# Altium project PB-F-0230 SUPI Medium R2.PrjPcb
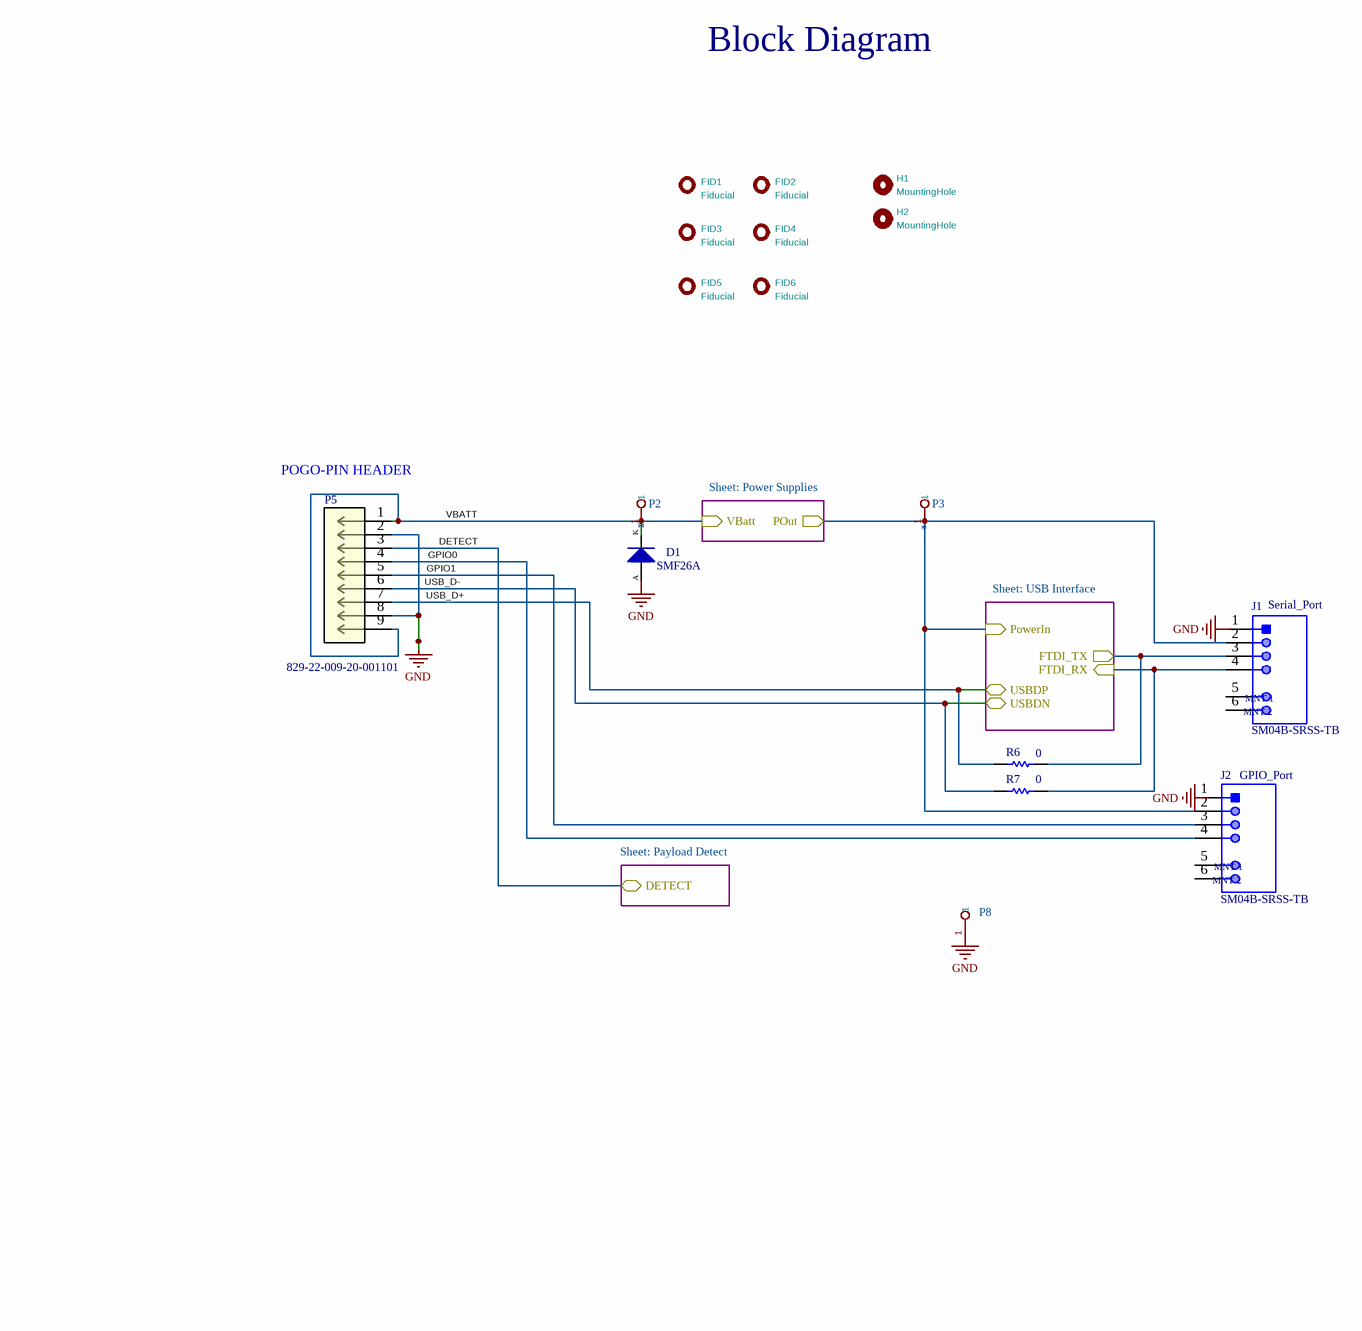
[diagram p0: SUPI_MediumR2.SchDoc]

4 sheets, 54 parts. Net scope: hierarchical (ports join the sheet entries above them; power ports are global).
Board file: SUPI_MediumR2.PcbDoc
Sheets:
  SUPI_MediumR2.SchDoc
    Payload Detect = payload_detect.SchDoc
    USB Interface = SOUP_USB.SchDoc
    Power Supplies = power_supplies.SchDoc

## Sheet SUPI_MediumR2.SchDoc
size 558 x 431 mm; SheetNumber: 1; SheetTotal: 4

### Parts
D1  SMF26A  [DI-SOD123F-A]
FID1  Fiducial  [Fiducial_Cu0.040_Mask0.060]  (no BOM)
FID2  Fiducial  [Fiducial_Cu0.040_Mask0.060]  (no BOM)
FID3  Fiducial  [Fiducial_Cu0.040_Mask0.060]  (no BOM)
FID4  Fiducial  [Fiducial_Cu0.040_Mask0.060]  (no BOM)
FID5  Fiducial  [Fiducial_Cu0.040_Mask0.060]  (no BOM)
FID6  Fiducial  [Fiducial_Cu0.040_Mask0.060]  (no BOM)
H1  MountingHole  [MountingHole_2.2mm_M2_DIN965]  (no BOM)
H2  MountingHole  [MountingHole_2.2mm_M2_DIN965]  (no BOM)
J1  SM04B-SRSS-TB  [SM04B-SRSS-TB]
J2  SM04B-SRSS-TB  [SM04B-SRSS-TB]
P2  *  [TP_SMD_1MM]  (no BOM)
P3  *  [TP_SMD_1MM]  (no BOM)
P5  829-22-009-20-001101  [829-22-009-20-001101]
P8  (no value)  [TP_SMD_1MM]  (no BOM)
R6  value 0  [RES-0402-A]  (hidden comment: Res 0402 0 Ohm 1/16W 5% Thick Film)
R7  value 0  [RES-0402-A]  (hidden comment: Res 0402 0 Ohm 1/16W 5% Thick Film)

### Sub-sheets
Payload Detect = payload_detect.SchDoc: DETECT (bidir)
Power Supplies = power_supplies.SchDoc: POut (out), VBatt (in)
USB Interface = SOUP_USB.SchDoc: FTDI_RX (in), FTDI_TX (out), USBDN (bidir), USBDP (bidir), PowerIn (in)

### Nets
GND: P5.2 P5.8 P8.1
DETECT: P5.3 ; sheet Payload Detect/DETECT
GPIO0: J2.4 P5.4
GPIO1: J2.3 P5.5
USB_D+: P5.7 R6.1 ; sheet USB Interface/USBDP
USB_D-: P5.6 R7.1 ; sheet USB Interface/USBDN
VBATT: D1.K P2.1 P5.1 P5.9 ; sheet Power Supplies/VBatt
NetC12_2: J1.2 J2.2 P3.1 ; sheet USB Interface/PowerIn, sheet Power Supplies/POut
NetJ1_3: J1.3 R6.2 ; sheet USB Interface/FTDI_TX
NetJ1_4: J1.4 R7.2 ; sheet USB Interface/FTDI_RX

Not connected (* = marked no-connect by the designer): D1 A; J1 1 5 6; J2 1 5 6

### Notes on the sheet
- Block Diagram
- (near P5) POGO-PIN HEADER
- Sheet: Power Supplies
- Sheet: USB Interface
- (near J1) Serial_Port
- (near J2) GPIO_Port
- Sheet: Payload Detect
- Labels drawn without touching a wire or pin: GND
- REVISIONS
- REVISION
- DESCRIPTION
- DATE(YEAR-MO-DA)
- APPROVED
- DWG NO
- SH
- THIS DRAWING IS CAD MAINTAINED.
  CHANGES SHALL BE INCORPORATED
  BY THE DESIGN ACTIVITY.
- PART NO.
- CONTRACT NUMBER
- DESIGN ACTIVITY
- CONTRACTOR
- US ARMY
  COMBAT CAPABILITIES DEVELOPMENT COMMAND ARMAMENTS CENTER
  PICATINNY ARSENAL, NEW JERSEY 07806-5000
- DRAWN BY
- ENGINEER
- CHECKER
- QUALITY ENGINEER
- DRAWING APPROVAL
- SIZE
- CAGE CODE
- DWG NO.
- NEXT ASSY
- USED ON
- DESIGN APPROVAL
- C
- 19200
- APPLICATION
- SCALE
- NONE
- UNIT WT.
- ---
- SHEET
- (in symbol CONN-00456-1) MNT 1; MNT 2

### Library data of the parts
D1 = CMP-00657-2: SMF Series 200 W 26 V Uni-Directional Surface Mount TVS Diode - SOD-123F; Breakdown Voltage: 30.4V; Clamping Voltage: 42.1V; Max Breakdown Voltage: 31.9V; Max Power Dissipation: 1W; Max Reverse Leakage Current: 1µA; Max Surge Current: 4.8A; Min Breakdown Voltage: 28.9V; Number of Channels: 1; Peak Pulse Power: 1kW; Polarity: Unidirectional; Power Line Protection: No; Reverse Standoff Voltage: 26V; Test Current: 1mA; Composition: Zener; Lead Free: Lead Free; Lifecycle Status: Production; Max Operating Temperature: 150°C; Min Operating Temperature: -65°C; Mounting Technology: Surface Mount; Number of Elements: 1; Number of Terminals: 2; Number of Unidirectional Channels: 1; Packaging: Cut Tape; Peak Pulse Current: 4.8A; Peak Reverse Current: 1µA; REACH SVHC: No; Reverse Voltage: 26V; RoHS: Compliant; Schedule B: 8541100080; Termination: SMD/SMT
FID1-FID6 = Fiducial_40mil_mask_60mil: Value: Fiducial
J1 J2 = CONN-00456-1: Conn Shrouded Header (4 Sides) HDR 4 POS 1.25mm Solder RA Side Entry SMD T/R; Connector Type: Male Pin; Number of Contacts: 4; Pitch: 990.6µm; Pin Count: 4; Pins: 6; Number of Positions: 4; Number of Rows: 1; Orientation: Right Angle
P2 P3 P8 = Hand_Solder_Pad_100x80_mil
P5 = CONN-00457-1: Board Connector, 9 Contact(s), 1 Row(s), Male, Right Angle, Solder Terminal; Leader Qty: 5; Number of Contacts: 9; Pitch: 2.54mm; System: Connector; Contact Gender: Male; Contact Plating: Gold; Number of Rows: 1; Termination: Solder
R6 R7 = RES-00249-8: Leader Qty: 100; Case/Package: 0402; Max Operating Temperature: 155°C; Min Operating Temperature: -55°C; RoHS Compliant: Yes
H1 H2 = MountingHole: Value: MountingHole

## Sheet payload_detect.SchDoc
size 558 x 431 mm; SheetNumber: 2; SheetTotal: 4
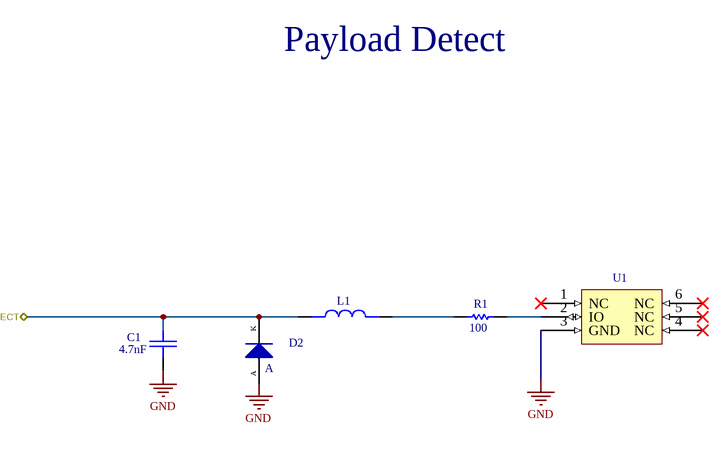
[diagram p1: payload_detect.SchDoc]

### Parts
C1  value 4.7nF  [CAP-0402-A]  (hidden comment: CAP 0402 4700PF 50V 10% X7R)
D2  A  [DI-SOD123F-A]
L1  MDF2016BSS270C  [IND-0806-A]  (value not drawn)
R1  value 100  [RES-0402-B]  (hidden comment: Res 0402 100 Ohm 0.1W 1% Thick Film)
U1  DS2431Q-TR  [IC-TDFN3X3-B]  (value not drawn)

### Ports
DETECT (bidir)

### Nets
GND: C1.1 U1.3(GND)
DETECT: C1.2 D2.K L1.1 ; port DETECT
NetL1_2: L1.2 R1.1
NetR1_2: R1.2 U1.2(IO)

Not connected (* = marked no-connect by the designer): D2 A; U1 1(NC)* 4(NC)* 5(NC)* 6(NC)*

### Notes on the sheet
- Payload Detect
- Labels drawn without touching a wire or pin: GND
- REVISIONS
- REVISION
- DESCRIPTION
- DATE(YEAR-MO-DA)
- APPROVED
- DWG NO
- SH
- THIS DRAWING IS CAD MAINTAINED.
  CHANGES SHALL BE INCORPORATED
  BY THE DESIGN ACTIVITY.
- PART NO.
- CONTRACT NUMBER
- DESIGN ACTIVITY
- CONTRACTOR
- US ARMY
  COMBAT CAPABILITIES DEVELOPMENT COMMAND ARMAMENTS CENTER
  PICATINNY ARSENAL, NEW JERSEY 07806-5000
- DRAWN BY
- ENGINEER
- CHECKER
- QUALITY ENGINEER
- DRAWING APPROVAL
- SIZE
- CAGE CODE
- DWG NO.
- NEXT ASSY
- USED ON
- DESIGN APPROVAL
- C
- 19200
- APPLICATION
- SCALE
- NONE
- UNIT WT.
- ---
- SHEET

### Library data of the parts
C1 = CAP-00371-1: Leader Qty: 100; UOM: EA; Case/Package: 0402; Max Operating Temperature: 150°C; Min Operating Temperature: -55°C; Mounting Technology: Surface Mount
D2 = CMP-004-00132-1: TVS Diodes & ESD Suppressors; P4FL3.3A_R1_00001; PANJIT; 3.3 V; 5.2 V; Polarity: Unidirectional; Case/Package: SOD123FL; Max Operating Temperature: 150°C; Min Operating Temperature: -55°C; Mounting Technology: SMT
L1 = CMP-00660-4: Ferrite Bead, Aec-Q200, 0806, 1A Rohs Compliant: Yes; Manufacturer Lifecycle Status: PRODUCTION; DC Resistance (DCR): 220mΩ; Impedance: 27Ω; Number of Circuits: 1; Current Rating: 1A; Export Control Classification Number (ECCN) Code: EAR99; Harmonized Tariff Schedule (HTS) Code: 8504.50.80.00; Height: 1mm; Introduction Date: 2021-03-10; Length: 2mm; Lifecycle Status: Production; Max Length: 2.2mm; Max Operating Temperature: 125°C; Max Width: 1.8mm; Min Length: 1.8mm; Min Operating Temperature: -40°C; Min Width: 1.4mm; Number of Terminals: 2; REACH SVHC: Yes; RoHS: Compliant; Width: 1.6mm
R1 = RES-00021-9: Voltage Rating: 100V; Case/Package: 0402; Leader Qty: 100; Max Operating Temperature: 155°C; Min Operating Temperature: -55°C; Mounting Technology: SMD; Pins: 2
U1 = IC-00419-6: IC EEPROM 1KBIT 1-WIRE 6TDFN; Manufacturer Lifecycle Status: PRODUCTION; Density: 1kb; Interface: Serial; Max Supply Voltage: 5.25V; Memory Size: 128B; Min Supply Voltage: 2.8V; Contact Plating: Tin; Lifecycle Status: Production; Max Operating Temperature: 85°C; Memory Format: EEPROM; Min Operating Temperature: -40°C; Pins: 6; Radiation Hardening: No; REACH SVHC: Unknown; RoHS: Compliant; Schedule B: 8542320050

## Sheet SOUP_USB.SchDoc
size 558 x 431 mm; SheetNumber: 4; SheetTotal: 4
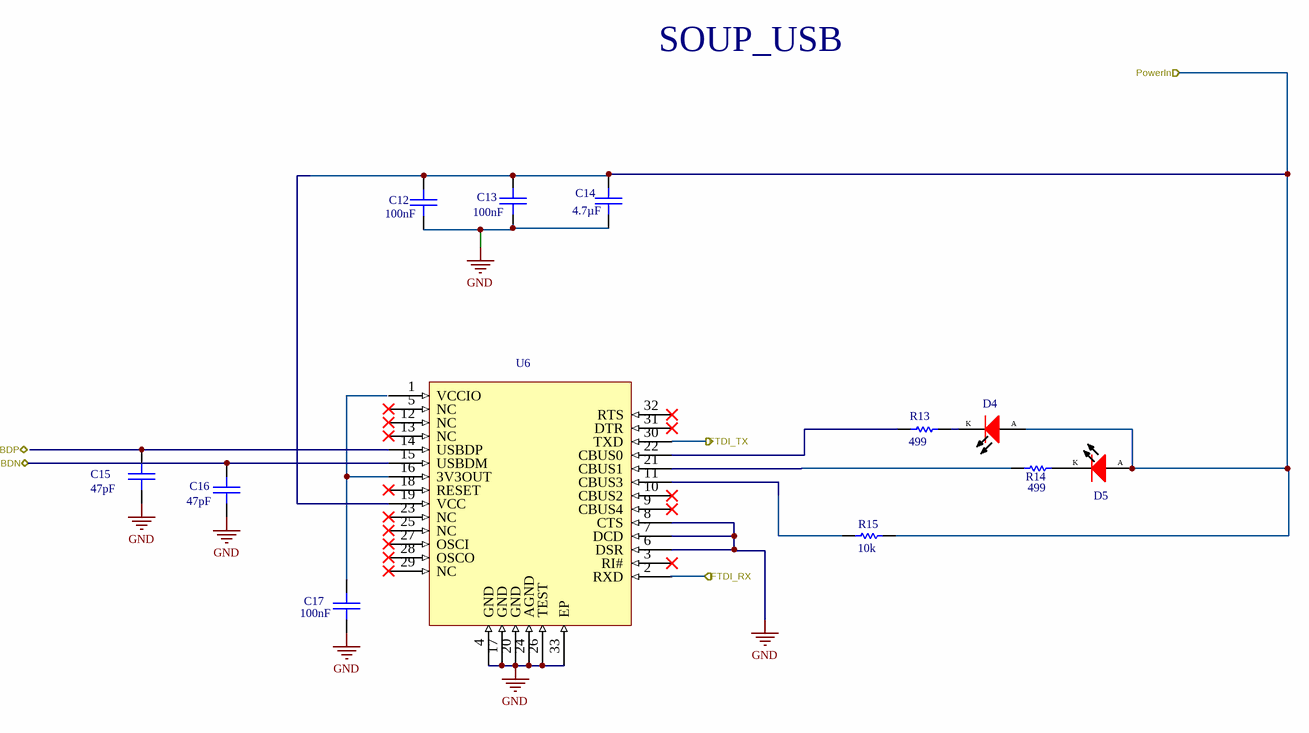
[diagram p2: SOUP_USB.SchDoc]

### Parts
C12  value 100nF  [CAP-0402-A]  (hidden comment: Cap 0402 0.1uf 25V 10% X7R)
C13  value 100nF  [CAP-0402-A]  (hidden comment: Cap 0402 0.1uf 25V 10% X7R)
C14  value 4.7µF  [CAP-0402-A]  (hidden comment: CAP 0402 4.7uF 6.3V 10% X5R)
C15  value 47pF  [CAP-0402-A]  (hidden comment: CAP 0402 47pF 50V 5% C0G/NP0)
C16  value 47pF  [CAP-0402-A]  (hidden comment: CAP 0402 47pF 50V 5% C0G/NP0)
C17  value 100nF  [CAP-0402-A]  (hidden comment: Cap 0402 0.1uf 25V 10% X7R)
D4  APT2012SECK/J3-PRV  [LED-0805-G-A]  (value not drawn)
D5  APT2012SECK/J3-PRV  [LED-0805-G-A]  (value not drawn)
R13  value 499  [RES-0402-A]  (hidden comment: RES 0402 499 OHM 1/10W 1%)
R14  value 499  [RES-0402-A]  (hidden comment: RES 0402 499 OHM 1/10W 1%)
R15  value 10k  [RES-0402-A]  (hidden comment: RES 0402 10K 1/10W 1%)
U6  FT232RNQ  [IC-QFN32-A]  (value not drawn)

### Ports
FTDI_RX (in), FTDI_TX (out), PowerIn (in), USBDN (bidir), USBDP (bidir)

### Nets
GND: C12.1 C13.1 C14.1 C15.1 C16.1 C17.1 U6.4(GND) U6.6(DSR) U6.7(DCD) U6.8(CTS) U6.17(GND) U6.20(GND) U6.24(AGND) U6.26(TEST) U6.33(EP)
USB_D-: C16.2 U6.15(USBDM) ; port USBDN
NetC12_2: C12.2 C13.2 C14.2 D4.A D5.A R15.1 U6.19(VCC) ; port PowerIn
NetC15_2: C15.2 U6.14(USBDP)
NetC17_2: C17.2 U6.16(3V3OUT)
NetD4_K: D4.K R13.2
NetD5_K: D5.K R14.2
NetJ1_3: U6.30(TXD) ; port FTDI_TX
NetJ1_4: U6.2(RXD) ; port FTDI_RX
NetR13_1: R13.1 U6.22(CBUS0)
NetR14_1: R14.1 U6.21(CBUS1)
NetR15_2: R15.2 U6.11(CBUS3)

Not connected (* = marked no-connect by the designer): U6 1(VCCIO) 3(RI#)* 5(NC)* 9(CBUS4)* 10(CBUS2)* 12(NC)* 13(NC)* 18(RESET)* 23(NC)* 25(NC)* 27(OSCI)* 28(OSCO)* 29(NC)* 31(DTR)* 32(RTS)*

### Notes on the sheet
- SOUP_USB
- REVISIONS
- REVISION
- DESCRIPTION
- DATE(YEAR-MO-DA)
- APPROVED
- DWG NO
- SH
- THIS DRAWING IS CAD MAINTAINED.
  CHANGES SHALL BE INCORPORATED
  BY THE DESIGN ACTIVITY.
- PART NO.
- CONTRACT NUMBER
- DESIGN ACTIVITY
- CONTRACTOR
- US ARMY
  COMBAT CAPABILITIES DEVELOPMENT COMMAND ARMAMENTS CENTER
  PICATINNY ARSENAL, NEW JERSEY 07806-5000
- DRAWN BY
- ENGINEER
- CHECKER
- QUALITY ENGINEER
- DRAWING APPROVAL
- SIZE
- CAGE CODE
- DWG NO.
- NEXT ASSY
- USED ON
- DESIGN APPROVAL
- C
- 19200
- APPLICATION
- SCALE
- NONE
- UNIT WT.
- ---
- SHEET

### Library data of the parts
C12 C13 C17 = CAP-00172-4: Multilayer Ceramic Capacitor, 0.1 uF, 25 V, ± 10%, X7R, 0402 [1005 Metric]; Leader Qty: 100; Case/Package: 0402; Max Operating Temperature: 125°C; Min Operating Temperature: -55°C; Mounting Technology: Surface Mount; Ratings: AEC-Q200; Reach SVHC Compliant: No; RoHS Compliant: Yes; Series: CGA; Termination: SMD/SMT; Tolerance: 10%; Voltage: 25V; Voltage Rating (DC): 25V; Voltage Rating: 25V
C14 = CAP-00128-6: Cap Ceramic 4.7uF 6.3V JB 10% SMD 0402 85°C Punched Paper T/R; Leader Qty: 100; Case/Package: 0402; Max Operating Temperature: 85°C; Min Operating Temperature: -25°C; RoHS Compliant: Yes; Tolerance: 10%; Voltage Rating: 6.3V
C15 C16 = CAP-00400-2: Leader Qty: 100; UOM: EA; Case/Package: 0402; Max Operating Temperature: 150°C; Min Operating Temperature: -55°C; Mounting Technology: Surface Mount; Tolerance: 5%; Voltage Rating: 50V
D4 D5 = CMP-00740-1: Red 625nm LED Indication - Discrete 2.2V 0805; Manufacturer Package Identifier: 0805 (2012 metric); Forward Current: 30mA; Lens Color: Colorless; Lens Transparency: Clear; Luminous Intensity: 1.1cd; Number of Circuits: 1; Peak Wavelength: 640nm; Shape: Rectangular; Test Current: 20mA; Viewing Angle: 120°; Case/Package: 0805; Case Code (Imperial): 0805; Case Code (Metric): 2012; China RoHS: Compliant; Color: Red; Country of Origin: Mainland China; Dominant Wavelength: 625nm; Forward Voltage: 2.2V; Harmonized Tariff Schedule (HTS) Code: 8541.40.20.00; Height: 750µm; Illumination Color: Red; Introduction Date: 2015-05-05; Lead Free: Lead Free; Length: 2mm; Lifecycle Status: Production; Max Operating Temperature: 85°C; Min Operating Temperature: -40°C; Mounting Technology: Surface Mount; Number of Terminals: 2; Packaging: Tape & Reel (TR); REACH SVHC: Yes; RoHS: Compliant; Schedule B: 8541402000, 8541402000; Terminal Pitch: 2.35mm; Width: 1.25mm
R13 R14 = RES-00802-1: Leader Qty: 100; UOM: EA; Voltage Rating: 50V; Case/Package: 0402; Max Operating Temperature: 155°C; Min Operating Temperature: -55°C; Mounting Technology: Surface Mount; Tolerance: 1%
R15 = RES-00803-1: Leader Qty: 100; UOM: EA; Voltage Rating: 75V; Case/Package: 0402; Max Operating Temperature: 155°C; Min Operating Temperature: -55°C; Mounting Technology: Surface Mount; Tolerance: 1%
U6 = IC-00470-3: USB Bridge, USB to UART USB 2.0 UART Interface 32-QFN (5x5); Clock Frequency: 12.02MHz; Data Rate: 60Mbps; Max Supply Voltage: 5.25V; Min Supply Voltage: 3.3V; Height - Seated (Max): 900µm; Interface: UART; Length: 5mm; Lifecycle Status: Production; Max Operating Temperature: 85°C; Min Operating Temperature: -40°C; Number of Terminals: 32; REACH SVHC: Yes; RoHS: Compliant; Terminal Pitch: 500µm; Width: 5mm; Case/Package: QFN32

## Sheet power_supplies.SchDoc
size 558 x 431 mm; SheetNumber: 3; SheetTotal: 4
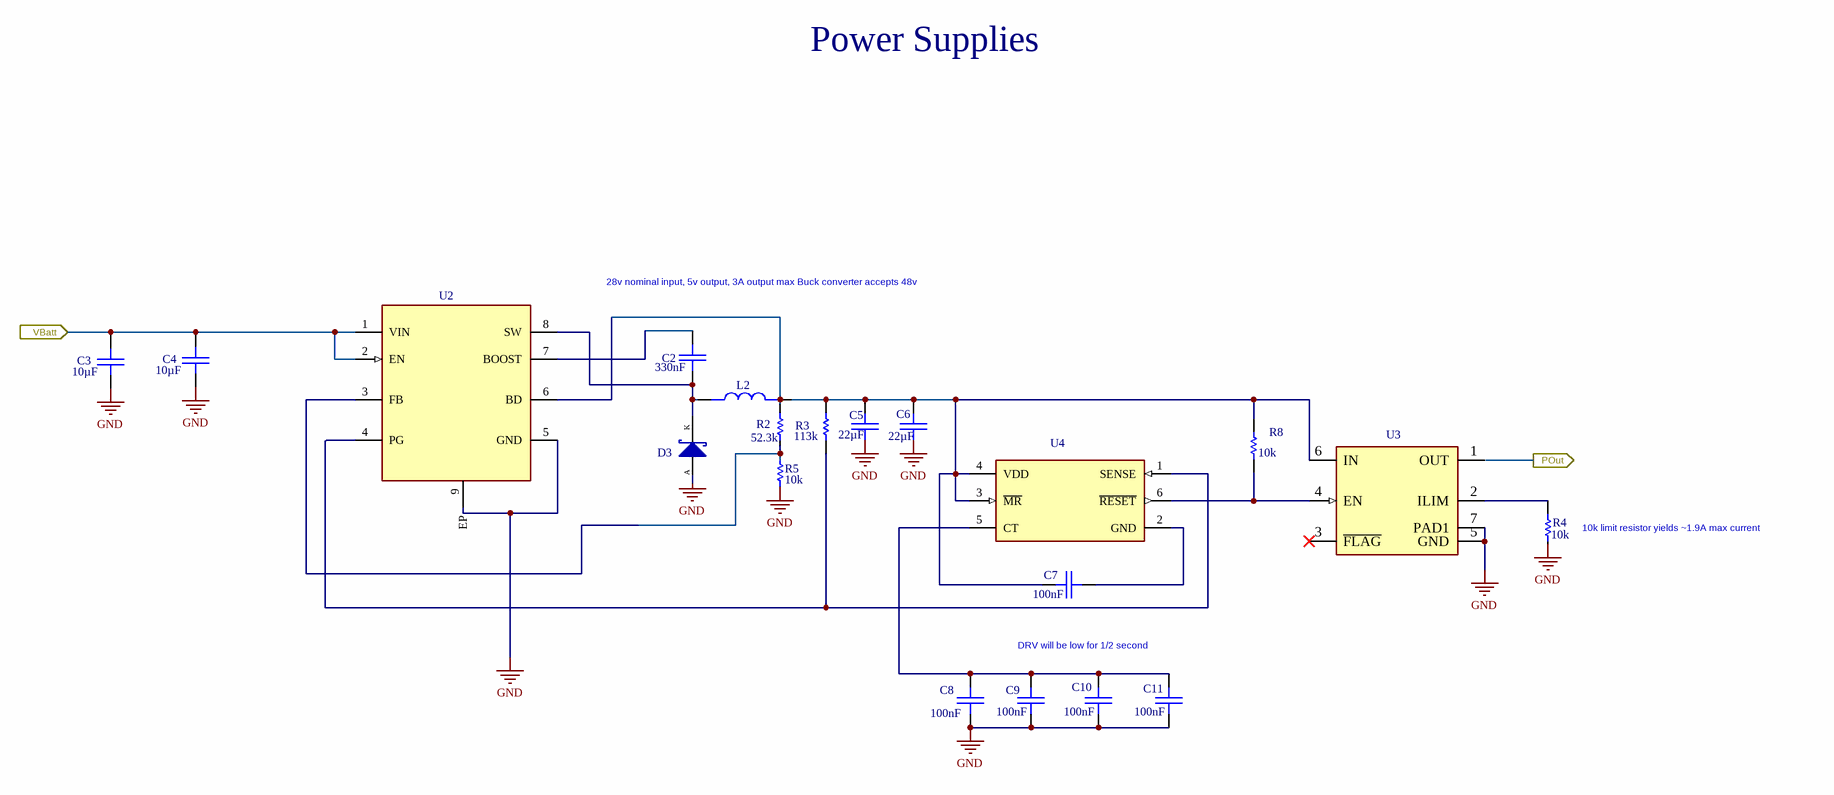
[diagram p3: power_supplies.SchDoc]

### Parts
C2  value 330nF  [CAP-0805-A]  (hidden comment: CAP 0805 0.33uF 50V 10% X7R CER)
C3  value 10µF  [CAP-0805-A]  (hidden comment: CAP 0805 10UF 50V 10% X5R)
C4  value 10µF  [CAP-0805-A]  (hidden comment: CAP 0805 10UF 50V 10% X5R)
C5  value 22µF  [CAP-0805-C]  (hidden comment: CAP 0805 22UF 16V 20% X5R)
C6  value 22µF  [CAP-0805-C]  (hidden comment: CAP 0805 22UF 16V 20% X5R)
C7  value 100nF  [CAP-0402-A]  (hidden comment: Cap 0402 0.1uf 25V 10% X7R)
C8  value 100nF  [CAP-0402-A]  (hidden comment: Cap 0402 0.1uf 25V 10% X7R)
C9  value 100nF  [CAP-0402-A]  (hidden comment: Cap 0402 0.1uf 25V 10% X7R)
C10  value 100nF  [CAP-0402-A]  (hidden comment: Cap 0402 0.1uf 25V 10% X7R)
C11  value 100nF  [CAP-0402-A]  (hidden comment: Cap 0402 0.1uf 25V 10% X7R)
D3  SS3060HE_R1_00001  [DI-SOD123HE-A]  (value not drawn)
L2  5-2176797-4  [IND-1210-A]  (value not drawn)
R2  value 52.3k  [RES-0402-C]  (hidden comment: Res 0402 52.3K 1/10W 1% Thick Flim)
R3  value 113k  [RES-0402-C]  (hidden comment: Res 0402 113K 1/10W 1% Thick Flim)
R4  value 10k  [RES-0402-A]  (hidden comment: RES 0402 10K 1/10W 1%)
R5  value 10k  [RES-0402-A]  (hidden comment: RES 0402 10K 1/10W 1%)
R8  value 10k  [RES-0402-A]  (hidden comment: RES 0402 10K 1/10W 1%)
U2  MCP16361T-E/NMX  [MCP16361T-E/NMX]  (value not drawn)
U3  NCP380HMUAJAAT  [IC-WDFN6-A]  (value not drawn)
U4  16399d4bb0613feb97433aaa3a53e95  [IC-WSON6-A]  (value not drawn)

### Ports
POut (out), VBatt (in)

### Nets
GND: C3.1 C4.1 C8.1 C9.1 C10.1 C11.1 D3.A U2.5(GND) U3.5(GND) U3.7(PAD1)
VBATT: C3.2 C4.2 U2.1(VIN) U2.2(EN) ; port VBatt
NetC2_1: C2.1 D3.K L2.1 U2.8(SW)
NetC2_2: C2.2 U2.7(BOOST)
NetC5_2: C5.2 C6.2 C7.1 L2.2 R3.2 R8.2 U3.6(IN) U4.3(~{MR}) U4.4(VDD)
NetC7_2: C7.2 U4.2(GND)
NetC8_2: C8.2 C9.2 C10.2 C11.2 U4.5(CT)
NetR2_1: R2.1 U2.6(BD)
NetR2_2: R2.2 R5.2 U2.3(FB)
NetR3_1: R3.1 U2.4(PG) U4.1(SENSE)
NetR4_2: R4.2 U3.2(ILIM)
NetR8_1: R8.1 U3.4(EN) U4.6(~{RESET})

Not connected (* = marked no-connect by the designer): C5 1; C6 1; R4 1; R5 1; U2 9(EP); U3 1(OUT) 3(~{FLAG})*

### Notes on the sheet
- Power Supplies
- 28v nominal input, 5v output, 3A output max
  Buck converter accepts 48v
- (near R4) 10k limit resistor yields ~1.9A max current
- DRV will be low for 1/2 second
- Labels drawn without touching a wire or pin: GND
- REVISIONS
- REVISION
- DESCRIPTION
- DATE(YEAR-MO-DA)
- APPROVED
- DWG NO
- SH
- THIS DRAWING IS CAD MAINTAINED.
  CHANGES SHALL BE INCORPORATED
  BY THE DESIGN ACTIVITY.
- PART NO.
- CONTRACT NUMBER
- DESIGN ACTIVITY
- CONTRACTOR
- US ARMY
  COMBAT CAPABILITIES DEVELOPMENT COMMAND ARMAMENTS CENTER
  PICATINNY ARSENAL, NEW JERSEY 07806-5000
- DRAWN BY
- ENGINEER
- CHECKER
- QUALITY ENGINEER
- DRAWING APPROVAL
- SIZE
- CAGE CODE
- DWG NO.
- NEXT ASSY
- USED ON
- DESIGN APPROVAL
- C
- 19200
- APPLICATION
- SCALE
- NONE
- UNIT WT.
- ---
- SHEET

### Library data of the parts
C2 = CAP-00399-2: Leader Qty: 100; UOM: EA; Case/Package: 0805; Max Operating Temperature: 125°C; Min Operating Temperature: -55°C; Mounting Technology: Surface Mount; Voltage Rating: 50V; Tolerance: 10%
C3 C4 = CAP-00370-1: Leader Qty: 100; UOM: EA; Case/Package: 0805; Dielectric: X5R; Max Operating Temperature: 85°C; Min Operating Temperature: -55°C; Mounting Technology: Surface Mount
C5 C6 = CAP-00013-15: Capacitor Type: Ceramic; Leader Qty: 100; UOM: EA; Case/Package: 0805; Max Operating Temperature: 85°C; Min Operating Temperature: -55°C; Mounting Technology: Surface Mount, MLCC; Pins: 2; Voltage Rating: 16V
C7-C11 = CAP-00172-4: as C12 on sheet SOUP_USB; Case/Package: 0402; Max Operating Temperature: 125°C; Min Operating Temperature: -55°C; Mounting Technology: Surface Mount; Ratings: AEC-Q200; Reach SVHC Compliant: No; RoHS Compliant: Yes; Series: CGA; Termination: SMD/SMT; Voltage: 25V; Voltage Rating (DC): 25V; Voltage Rating: 25V
D3 = CMP-00739-3: DIODE SCHOTTKY 60V 3A SOD123HE; Forward Voltage: 650mV; Max Forward Surge Current (Ifsm): 80A; Number of Elements: 1; Peak Reverse Current: 100µA; Export Control Classification Number (ECCN) Code: EAR99; Harmonized Tariff Schedule (HTS) Code: 8541.10.00.80; Introduction Date: 2012-03-14; Lifecycle Status: Production; Max Operating Temperature: 150°C; Max Output current: 3A; Min Operating Temperature: -55°C; Number of Terminals: 2; REACH SVHC: No; Reverse Standoff Voltage: 60V; RoHS: Compliant
L2 = CMP-00741-1: FIXED IND 2.2UH 3A 72 MOHM SMD; Export Control Classification Number (ECCN) Code: EAR99; Harmonized Tariff Schedule (HTS) Code: 8504.50.80.00; Introduction Date: 2025-08-22; Lifecycle Status: Production; RoHS: Compliant
R2 = RES-00761-2: Leader Qty: 100; UOM: EA; Voltage Rating: 50V; Case/Package: 0402; Max Operating Temperature: 155°C; Min Operating Temperature: -55°C; Mounting Technology: Surface Mount; Tolerance: 1%
R3 = RES-00724-3: Leader Qty: 100; Max Power Dissipation: 63mW; Voltage Rating: 50V; UOM: EA; Case/Package: 0402; Case Code (Imperial): 0402; Case Code (Metric): 1005; Max Operating Temperature: 155°C; Min Operating Temperature: -55°C; Mounting Technology: Surface Mount; Number of Terminals: 2; Packaging: Tape & Reel; Tolerance: 1%
R4 R5 R8 = RES-00803-1: as R15 on sheet SOUP_USB; Case/Package: 0402; Max Operating Temperature: 155°C; Min Operating Temperature: -55°C; Mounting Technology: Surface Mount
U2 = IC-00466-4: IC BUCK CONVERTER 48V 2MHZ; Manufacturer Lifecycle Status: REL; Max Duty Cycle: 87%; Max Junction Temperature (Tj): 125°C; Min Supply Voltage: 4V; Number of Channels: 1; Output Current: 3A; Switching Frequency: 2.2MHz; Ambient Temperature Range High: 150°C; Country of Assembly: Taiwan; Country of Fabrication: Taiwan; Country of Origin: Taiwan; Export Control Classification Number (ECCN) Code: EAR99; Harmonized Tariff Schedule (HTS) Code: 8542.39.0060; Height: 900µm; HS Code: 8542.39.0090; Introduction Date: 2020-12-15; Lifecycle Status: Production; Max Operating Temperature: 125°C; Max Supply Voltage: 48V; Min Operating Temperature: -40°C; Number of Outputs: 1; Pins: 8; Projected EOL Date: 2044-12-15; RoHS: Compliant; Topology: Buck
U3 = IC-00468-3: Power Distribution Switch, Current-Limiting (Fixed and Adjustable) Adjustable, Enable H; Manufacturer Lifecycle Status: ACTIVE; Current Rating: 2.1A; Interface: On/Off; Max Junction Temperature (Tj): 125°C; Max Power Dissipation: 830mW; Max Supply Voltage: 5.5V; Min Input Voltage: 2.5V; Nominal Supply Current: 90µA; Nominal Supply Voltage (DC): 5V; Number of Channels: 1; Number of Inputs: 2; Output Configuration: High Side; Turn-Off Delay Time: 3ms; Turn-On Delay Time: 4ms; Value: 110mΩ; Ambient Temperature Range High: 85°C; China RoHS: Compliant; Halogen Free: Halogen Free; Height - Seated (Max): 550µm; Height: 550µm; Lead Free: Lead Free; Length: 2mm; Lifecycle Status: Production; Max Operating Temperature: 85°C; Max Output current: 2.1A; Min Operating Temperature: -40°C; Min Supply Voltage: 2.5V; Mounting Technology: Surface Mount; Nominal Supply Voltage: 5.5V; Number of Circuits: 1; Number of Outputs: 1; Number of Terminals: 6; Operating Supply Voltage: 5.5V; Packaging: Cut Tape; Pins: 6; Radiation Hardening: No; REACH SVHC: Yes; RoHS: Compliant; Schedule B: 8542390000; Temperature Grade: Industrial; Terminal Pitch: 650µm; Width: 2mm; Case/Package: WDFN6
U4 = IC-00469-2: Supervisor Open Drain or Open Collector 1 Channel 6-WSON (1.5x1.5); Manufacturer Lifecycle Status: ACTIVE; Max Junction Temperature (Tj): 125°C; Max Supply Voltage: 5.5V; Min Supply Voltage: 1.5V; Number of Outputs: 1; Quiescent Current: 2µA; Height: 800µm; Lead Free: Lead Free; Length: 1.5mm; Lifecycle Status: Production; Max Operating Temperature: 125°C; Min Operating Temperature: -40°C; Number of Voltages Monitored: 1; Pins: 6; RoHS: Compliant; Schedule B: 8542390000, 8542390000; Thickness: 750µm; Width: 1.5mm; Case/Package: WSON6

## Nets that join several sheets
GND: SUPI_MediumR2 (P5.2 P5.8 P8.1), payload_detect (C1.1 U1.3), SOUP_USB (15 pins), power_supplies (10 pins)
DETECT: SUPI_MediumR2 (P5.3), payload_detect (C1.2 D2.K L1.1)
NetC12_2: SUPI_MediumR2 (J1.2 J2.2 P3.1), SOUP_USB (7 pins)
NetJ1_3: SUPI_MediumR2 (J1.3 R6.2), SOUP_USB (U6.30)
NetJ1_4: SUPI_MediumR2 (J1.4 R7.2), SOUP_USB (U6.2)
USB_D-: SUPI_MediumR2 (P5.6 R7.1), SOUP_USB (C16.2 U6.15)
VBATT: SUPI_MediumR2 (D1.K P2.1 P5.1 P5.9), power_supplies (C3.2 C4.2 U2.1 U2.2)

## Assembly variants
Variant of PB-F-0230 SUPI Medium R2: not fitted R6 R7